# Altium schematic sheet Sensor-PCB.SchDoc: Bracelet-PCB
size A3; CompanyName: ETH Zurich; Revision: V1.0; SheetNumber: 1; SheetTotal: 1; Time: 14.10.2021
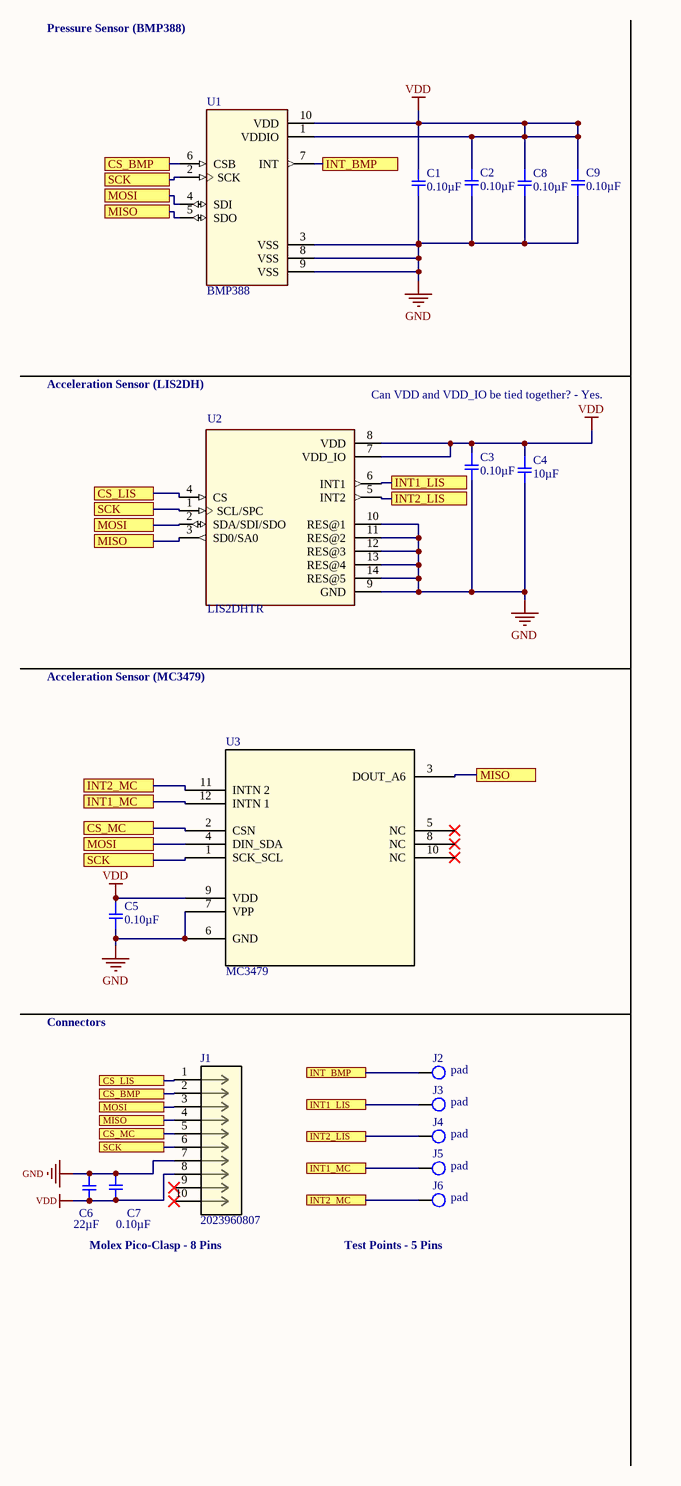
[diagram p0: Sensor-PCB.SchDoc]

## Parts
C1  0.10µF  [SMD-0603C]
C2  0.10µF  [SMD-0603C]
C3  0.10µF  [SMD-0603C]
C4  10µF  [SMD-0603C]
C5  0.10µF  [SMD-0603C]
C6  22µF  [SMD-0603C]
C7  0.10µF  [SMD-0603C]
C8  0.10µF  [SMD-0603C]
C9  0.10µF  [SMD-0603C]
J1  2023960807  [CON_2023960807]
J2  pad  [pad rect 1.5x3mm - duplicate]  (no BOM)
J3  pad  [pad rect 1.5x3mm - duplicate]  (no BOM)
J4  pad  [pad rect 1.5x3mm - duplicate]  (no BOM)
J5  pad  [pad rect 1.5x3mm - duplicate]  (no BOM)
J6  pad  [pad rect 1.5x3mm - duplicate]  (no BOM)
U1  BMP388  [*PQFN50P200X200X80-10N]
U2  LIS2DHTR  [*PQFN35P200X200X100-14N]
U3  MC3479  [MC3479_MEM]

## Ports
CS_BMP, CS_LIS, CS_MC, INT1_LIS, INT1_MC, INT2_LIS, INT2_MC, INT_BMP, MISO, MOSI, SCK

## Nets
GND: C1.2 C2.2 C3.2 C4.2 C5.2 C6.1 C7.1 C8.2 C9.2 J1.7 U1.3(VSS) U1.8(VSS) U1.9(VSS) U2.9(GND) U2.10(RES@1) U2.11(RES@2) U2.12(RES@3) U2.13(RES@4) U2.14(RES@5) U3.6(GND) U3.7(VPP)
VDD: C1.1 C2.1 C3.1 C4.1 C5.1 C6.2 C7.2 C8.1 C9.1 J1.8 U1.1(VDDIO) U1.10(VDD) U2.7(VDD_IO) U2.8(VDD) U3.9(VDD)
CS_BMP: J1.2 U1.6(CSB) ; port CS_BMP
CS_LIS: J1.1 U2.4(CS) ; port CS_LIS
CS_MC: J1.5 U3.2(CSN) ; port CS_MC
INT1_LIS: J3.1 U2.6(INT1) ; port INT1_LIS
INT1_MC: J5.1 U3.12(INTN_1) ; port INT1_MC
INT2_LIS: J4.1 U2.5(INT2) ; port INT2_LIS
INT2_MC: J6.1 U3.11(INTN_2) ; port INT2_MC
INT_BMP: J2.1 U1.7(INT) ; port INT_BMP
MISO: J1.4 U1.5(SDO) U2.3(SD0/SA0) U3.3(DOUT_A6) ; port MISO
MOSI: J1.3 U1.4(SDI) U2.2(SDA/SDI/SDO) U3.4(DIN_SDA) ; port MOSI
SCK: J1.6 U1.2(SCK) U2.1(SCL/SPC) U3.1(SCK_SCL) ; port SCK

Not connected (* = marked no-connect by the designer): J1 9* 10*; U3 5(NC)* 8(NC)* 10(NC)*

## Notes on the sheet
- Pressure Sensor (BMP388)
- (near U2) Acceleration Sensor (LIS2DH)
- Can VDD and VDD_IO be tied together? - Yes.
- Acceleration Sensor (MC3479)
- Connectors
- Molex Pico-Clasp - 8 Pins
- (near J6) Test Points - 5 Pins

## Library data of the parts
C1-C3 C5 C7-C9 = GCJ188R71C104KA01D: CAP CER 0.1UF 16V X7R 0603; Manufacturer: Murata Electronics North America; Factory Stock: 0; Unit Price (USD): 0.21; Minimum Quantity: 1; Tolerance: ±10%; Datasheets: http://www.murata.com/~/media/webrenewal/support/library/catalog/products/capacitor/mlcc/c03e.ashx; Image: //media.digikey.com/Renders/Murata%20Renders/0603%28LQG18%29.jpg; Digi-Key Part Number: 490-5796-1-ND; Part Number: GCJ188R71C104KA01D; Quantity Available: 22473; @ qty: 0; Packaging: Cut Tape (CT); Series: GCJ; Part Status: Active; Value: 0.10µF; Voltage: 16V; Temperature Coefficient: X7R; Operating Temperature: -55°C ~ 125°C; Features: Soft Termination; Ratings: AEC-Q200; Applications: Automotive, Boardflex Sensitive; Mounting Type: Surface Mount, MLCC; Package / Case: 0603 (1608 Metric); Size / Dimension: 0.063" L x 0.031" W (1.60mm x 0.80mm); Height - Seated (Max): -; Thickness (Max): 0.035" (0.90mm); Lead Spacing: -; Lead Style: -
C4 = GRM188C81A106MA73D: CAP CER 10UF 10V X6S 0603; Manufacturer: Murata Electronics North America; Factory Stock: 0; Unit Price (USD): 0.34; Minimum Quantity: 1; Tolerance: ±20%; Datasheets: http://www.murata.com/~/media/webrenewal/support/library/catalog/products/capacitor/mlcc/c02e.pdf; Image: //media.digikey.com/Renders/Murata%20Renders/ZRB-SERIES-0402.jpg; Digi-Key Part Number: 490-7197-1-ND; Part Number: GRM188C81A106MA73D; Quantity Available: 213983; @ qty: 0; Packaging: Cut Tape (CT); Series: GRM; Part Status: Active; Value: 10µF; Voltage: 10V; Temperature Coefficient: X6S; Operating Temperature: -55°C ~ 105°C; Features: -; Ratings: -; Applications: General Purpose; Mounting Type: Surface Mount, MLCC; Package / Case: 0603 (1608 Metric); Size / Dimension: 0.063" L x 0.031" W (1.60mm x 0.80mm); Height - Seated (Max): -; Thickness (Max): 0.031" (0.80mm); Lead Spacing: -; Lead Style: -
C6 = GRM188R61A226ME15D: CAP CER 22UF 10V X5R 0603; Manufacturer: Murata Electronics North America; Factory Stock: 0; Unit Price (USD): 0.24; Minimum Quantity: 1; Tolerance: ±20%; Datasheets: http://www.murata.com/~/media/webrenewal/support/library/catalog/products/capacitor/mlcc/c02e.pdf; Image: //media.digikey.com/Renders/Murata%20Renders/ZRB-SERIES-0402.jpg; Digi-Key Part Number: 490-10476-1-ND; Part Number: GRM188R61A226ME15D; Quantity Available: 179406; @ qty: 0; Packaging: Cut Tape (CT); Series: GRM; Part Status: Active; Value: 22µF; Voltage: 10V; Temperature Coefficient: X5R; Operating Temperature: -55°C ~ 85°C; Features: Derating Recommended; Ratings: -; Applications: General Purpose; Mounting Type: Surface Mount, MLCC; Package / Case: 0603 (1608 Metric); Size / Dimension: 0.063" L x 0.031" W (1.60mm x 0.80mm); Height - Seated (Max): -; Thickness (Max): 0.039" (1.00mm); Lead Spacing: -; Lead Style: -
J1 = 2023960807: No Description Available; Mfr_Name: Molex Connector Corporation; Copyright: Copyright (C) 2021 Ultra Librarian. All rights reserved.; Manufacturer_Part_Number: 2023960807; RefDes: RefDes; Type: DEV
U1 = BMP388: P-Sensor SPI I2C 1, 25 Bar SMD; MF: Bosch Sensortec; Package: WFLGA-10 Bosch Tools; Digi-Key_Part_Number: 828-1079-1-ND; SnapEDA_Link: https://www.snapeda.com/parts/BMP388/Bosch%20Sensortec/view-part/?ref=snap; Digi-Key_Purchase_URL: https://www.digikey.ch/product-detail/en/bosch-sensortec/BMP388/828-1079-1-ND/8322640?utm_source=snapeda&utm_medium=aggregator&utm_campaign=symbol; MP: BMP388; Value: *
U2 = LIS2DHTR: ACCEL 2-16G I2C/SPI 14LGA; Manufacturer: STMicroelectronics; SnapEDA_Link: https://www.snapeda.com/parts/LIS2DHTR/STMicroelectronics/view-part/45205/?ref=snap; Digi-Key Part Number: 497-13795-1-ND; Digi-Key_Purchase_URL: https://www.digikey.ch/product-detail/en/stmicroelectronics/LIS2DHTR/497-13795-1-ND/4209308?utm_source=snapeda&utm_medium=aggregator&utm_campaign=symbol; Part Number: LIS2DHTR; Package / Case: LGA-14; Value: *
U3 = MC3479: No Description Available; Mfr_Name: Memsic; Copyright: Copyright (C) 2021 Ultra Librarian. All rights reserved.; Manufacturer_Part_Number: MC3479; RefDes: RefDes; Type: DEV